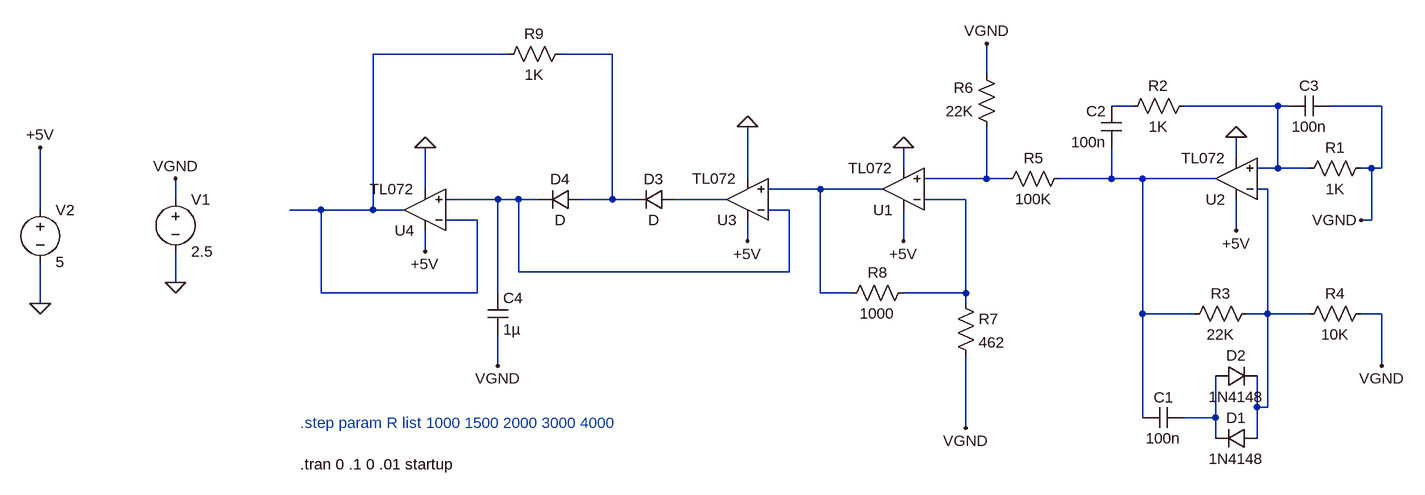
[diagram p0: schematic EC_Circuit.asc]
EC_Circuit.asc, the LTspice schematic file:
Version 4
SHEET 1 1584 680
WIRE 208 -160 0 -160
WIRE 368 -160 288 -160
WIRE 944 -128 944 -176
WIRE 1168 -80 1136 -80
WIRE 1392 -80 1248 -80
WIRE 1408 -80 1392 -80
WIRE 1552 -80 1472 -80
WIRE 1328 0 1328 -32
WIRE 816 16 816 -16
WIRE 1392 16 1392 -80
WIRE 1392 16 1360 16
WIRE 1440 16 1392 16
WIRE 1536 16 1520 16
WIRE 1552 16 1552 -80
WIRE 1552 16 1536 16
WIRE 576 32 576 -48
WIRE 944 32 944 -48
WIRE 944 32 848 32
WIRE 976 32 944 32
WIRE 1136 32 1136 -16
WIRE 1136 32 1056 32
WIRE 1184 32 1136 32
WIRE 1296 32 1184 32
WIRE 80 48 80 -16
WIRE 688 48 608 48
WIRE 784 48 688 48
WIRE 1376 48 1360 48
WIRE -304 64 -304 32
WIRE 192 64 112 64
WIRE 224 64 192 64
WIRE 256 64 224 64
WIRE 368 64 368 -160
WIRE 368 64 320 64
WIRE 400 64 368 64
WIRE 544 64 464 64
WIRE 912 64 848 64
WIRE -512 80 -512 -16
WIRE -80 80 -128 80
WIRE 0 80 0 -160
WIRE 0 80 -80 80
WIRE 48 80 0 80
WIRE 640 80 608 80
WIRE 160 96 112 96
WIRE 1536 96 1536 16
WIRE 1536 96 1520 96
WIRE 1328 112 1328 64
WIRE 576 128 576 96
WIRE 816 128 816 80
WIRE 80 144 80 112
WIRE 224 176 224 64
WIRE 640 176 640 80
WIRE 640 176 224 176
WIRE -304 192 -304 144
WIRE -80 208 -80 80
WIRE 160 208 160 96
WIRE 160 208 -80 208
WIRE 192 208 192 64
WIRE 688 208 688 48
WIRE 736 208 688 208
WIRE 912 208 912 64
WIRE 912 208 816 208
WIRE -512 224 -512 160
WIRE 912 224 912 208
WIRE 1184 240 1184 32
WIRE 1264 240 1184 240
WIRE 1376 240 1376 48
WIRE 1376 240 1344 240
WIRE 1440 240 1376 240
WIRE 1552 240 1520 240
WIRE 192 320 192 272
WIRE 1552 320 1552 240
WIRE 1360 384 1360 336
WIRE 1376 384 1376 240
WIRE 1376 384 1360 384
WIRE 1184 400 1184 240
WIRE 1296 400 1296 336
WIRE 1296 400 1248 400
WIRE 912 416 912 304
WIRE 1296 432 1296 400
WIRE 1360 432 1360 384
FLAG -304 32 VGND
FLAG -304 192 0
FLAG 1552 320 VGND
FLAG 1520 96 VGND
FLAG -512 224 0
FLAG -512 -16 +5V
FLAG 1328 112 +5V
FLAG 1328 -32 0
FLAG 944 -176 VGND
FLAG 912 416 VGND
FLAG 816 -16 0
FLAG 816 128 +5V
FLAG 192 320 VGND
FLAG 80 -16 0
FLAG 80 144 +5V
FLAG 576 -48 0
FLAG 576 128 +5V
SYMBOL voltage -304 48 R0
SYMATTR InstName V1
SYMATTR Value 2.5
SYMBOL res 1536 0 R90
WINDOW 0 0 56 VBottom 2
WINDOW 3 32 56 VTop 2
SYMATTR InstName R1
SYMATTR Value 1K
SYMBOL res 1264 -96 R90
WINDOW 0 0 56 VBottom 2
WINDOW 3 32 56 VTop 2
SYMATTR InstName R2
SYMATTR Value 1K
SYMBOL res 1360 224 R90
WINDOW 0 0 56 VBottom 2
WINDOW 3 32 56 VTop 2
SYMATTR InstName R3
SYMATTR Value 22K
SYMBOL res 1536 224 R90
WINDOW 0 0 56 VBottom 2
WINDOW 3 32 56 VTop 2
SYMATTR InstName R4
SYMATTR Value 10K
SYMBOL cap 1248 384 R90
WINDOW 0 0 32 VBottom 2
WINDOW 3 32 32 VTop 2
SYMATTR InstName C1
SYMATTR Value 100n
SYMBOL cap 1152 -16 R180
WINDOW 0 24 56 Left 2
WINDOW 3 24 8 Left 2
SYMATTR InstName C2
SYMATTR Value 100n
SYMBOL diode 1360 416 R90
WINDOW 0 0 32 VBottom 2
WINDOW 3 32 32 VTop 2
SYMATTR InstName D1
SYMATTR Value 1N4148
SYMBOL diode 1296 352 R270
WINDOW 0 32 32 VTop 2
WINDOW 3 0 32 VBottom 2
SYMATTR InstName D2
SYMATTR Value 1N4148
SYMBOL cap 1472 -96 R90
WINDOW 0 0 32 VBottom 2
WINDOW 3 32 32 VTop 2
SYMATTR InstName C3
SYMATTR Value 100n
SYMBOL TL072 1328 96 R180
SYMATTR InstName U2
SYMBOL voltage -512 64 R0
WINDOW 123 0 0 Left 2
WINDOW 39 0 0 Left 2
SYMATTR InstName V2
SYMATTR Value 5
SYMBOL res 1072 16 R90
WINDOW 0 0 56 VBottom 2
WINDOW 3 32 56 VTop 2
SYMATTR InstName R5
SYMATTR Value 100K
SYMBOL res 960 -32 R180
WINDOW 0 36 76 Left 2
WINDOW 3 36 40 Left 2
SYMATTR InstName R6
SYMATTR Value 22K
SYMBOL TL072 816 112 R180
SYMATTR InstName U1
SYMBOL res 896 208 R0
SYMATTR InstName R7
SYMATTR Value 462
SYMBOL res 832 192 R90
WINDOW 0 0 56 VBottom 2
WINDOW 3 32 56 VTop 2
SYMATTR InstName R8
SYMATTR Value 1000
SYMBOL TL072 576 128 R180
SYMATTR InstName U3
SYMBOL diode 464 48 R90
WINDOW 0 0 32 VBottom 2
WINDOW 3 32 32 VTop 2
SYMATTR InstName D3
SYMBOL diode 320 48 R90
WINDOW 0 0 32 VBottom 2
WINDOW 3 32 32 VTop 2
SYMATTR InstName D4
SYMBOL TL072 80 144 R180
SYMATTR InstName U4
SYMBOL cap 176 208 R0
SYMATTR InstName C4
SYMATTR Value 1µ
SYMBOL res 304 -176 R90
WINDOW 0 0 56 VBottom 2
WINDOW 3 32 56 VTop 2
SYMATTR InstName R9
SYMATTR Value 1K
TEXT -112 472 Left 2 !.tran 0 .1 0 .01 startup
TEXT -112 408 Left 2 ;.step param R list 1000 1500 2000 3000 4000

The netlist it stands for:
* EC_Circuit.asc
V1 VGND 0 2.5
R1 VGND N004 1K
R2 N004 N003 1K
R3 N008 N006 22K
R4 VGND N008 10K
C1 N012 N006 100n
C2 N006 N003 100n
D1 N008 N012 1N4148
D2 N012 N008 1N4148
C3 VGND N004 100n
* U2: TL072 (symbol TL072 not available, pins judged from their places): In+=N004 In-=N008 V+=+5V V-=0 OUT=N006
V2 +5V 0 5
R5 N006 N005 100K
R6 N005 VGND 22K
* U1: TL072 (symbol TL072 not available, pins judged from their places): In+=N005 In-=N011 V+=+5V V-=0 OUT=N007
R7 N011 VGND 462
R8 N011 N007 1000
* U3: TL072 (symbol TL072 not available, pins judged from their places): In+=N007 In-=N009 V+=+5V V-=0 OUT=N010
D3 N010 N002 D
D4 N002 N009 D
* U4: TL072 (symbol TL072 not available, pins judged from their places): In+=N009 In-=N001 V+=+5V V-=0 OUT=N001
C4 N009 VGND 1µ
R9 N002 N001 1K
.model D D
.lib standard.dio
.tran 0 .1 0 .01 startup
* .step param R list 1000 1500 2000 3000 4000
.backanno
.end